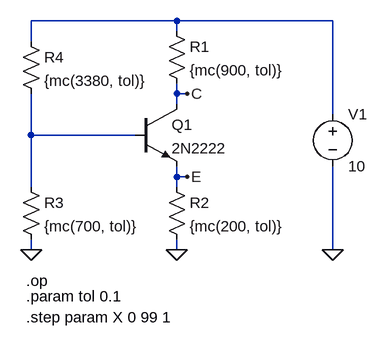
[diagram p0: schematic lista6_za1.asc]
lista6_za1.asc, the LTspice schematic file:
Version 4.1
SHEET 1 880 680
WIRE 208 -48 -16 -48
WIRE 448 -48 208 -48
WIRE 208 -32 208 -48
WIRE -16 -16 -16 -48
WIRE 208 64 208 48
WIRE 224 64 208 64
WIRE 208 80 208 64
WIRE 448 96 448 -48
WIRE -16 128 -16 64
WIRE 144 128 -16 128
WIRE 208 192 208 176
WIRE 224 192 208 192
WIRE -16 208 -16 128
WIRE 208 208 208 192
WIRE -16 304 -16 288
WIRE 208 304 208 288
WIRE 448 304 448 176
FLAG 208 304 0
FLAG -16 304 0
FLAG 448 304 0
FLAG 224 64 C
FLAG 224 192 E
SYMBOL npn 144 80 R0
SYMATTR InstName Q1
SYMATTR Value 2N2222
SYMBOL res 192 -48 R0
SYMATTR InstName R1
SYMATTR Value {mc(900, tol)}
SYMBOL res 192 192 R0
SYMATTR InstName R2
SYMATTR Value {mc(200, tol)}
SYMBOL res -32 192 R0
SYMATTR InstName R3
SYMATTR Value {mc(700, tol)}
SYMBOL res -32 -32 R0
SYMATTR InstName R4
SYMATTR Value {mc(3380, tol)}
SYMBOL voltage 448 80 R0
WINDOW 123 0 0 Left 0
WINDOW 39 0 0 Left 0
SYMATTR InstName V1
SYMATTR Value 10
TEXT -24 352 Left 2 !.op
TEXT -24 376 Left 2 !.param tol 0.1
TEXT -24 408 Left 2 !.step param X 0 99 1

The netlist it stands for:
* lista6_za1.asc
Q1 C N002 E 0 2N2222
R1 N001 C {mc(900, tol)}
R2 E 0 {mc(200, tol)}
R3 N002 0 {mc(700, tol)}
R4 N001 N002 {mc(3380, tol)}
V1 N001 0 10
.model NPN NPN
.model PNP PNP
.lib standard.bjt
.op
.param tol 0.1
.step param X 0 99 1
.backanno
.end